# EAGLE design DueShield2 (EAGLE 9.0.1)
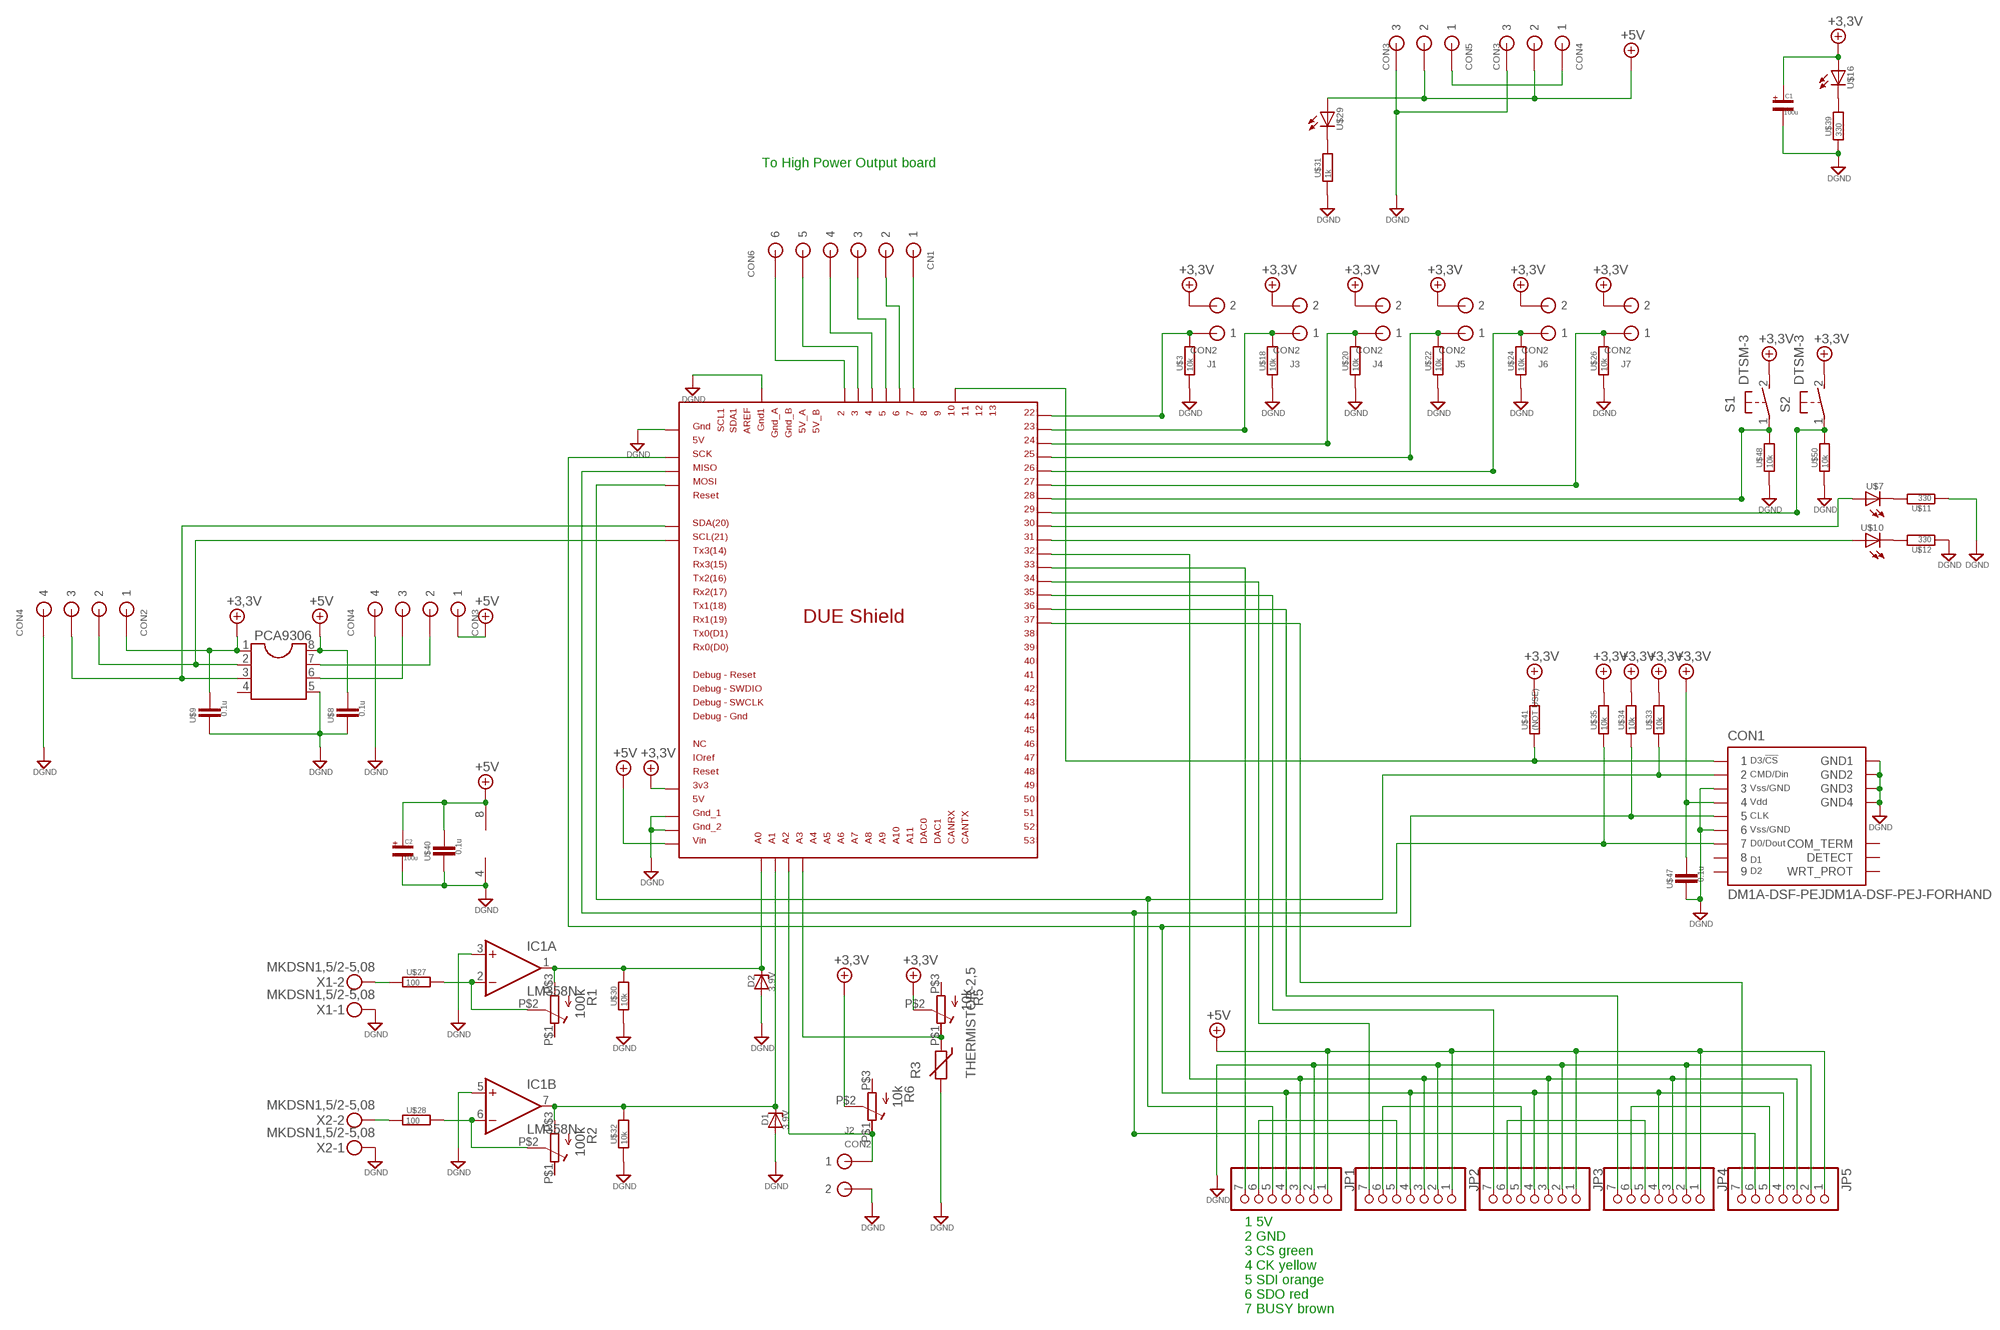
[diagram p0: schematic, sheet 1]

## Parts
C1  100u  コンデンサ(電解)E2.5-6  [D=1,φ=6]
C2  100u  コンデンサ(電解)E2.5-6  [D=1,φ=6]
CN1  CON6  [CON6]
CON1  DM1A-DSF-PEJDM1A-DSF-PEJ-FORHAND  [DM1A-DSF-PEJ-FORHAND]
CON2  CON4  [CON4]
CON3  CON4  [CON4]
CON4  CON3  [CON3]
CON5  CON3  [CON3]
D1  3.9V  (汎用)ツェナーダイオード  [SMD1206]
D2  3.9V  (汎用)ツェナーダイオード  [SMD1206]
IC1  LM358N  [DIL08]
J1  CON2  [CON2]
J2  CON2  [CON2]
J3  CON2  [CON2]
J4  CON2  [CON2]
J5  CON2  [CON2]
J6  CON2  [CON2]
J7  CON2  [CON2]
JP1  PINHD-1X7  [1X07]
JP2  PINHD-1X7  [1X07]
JP3  PINHD-1X7  [1X07]
JP4  PINHD-1X7  [1X07]
JP5  PINHD-1X7  [1X07]
PCA9306  DIL8  [DIL08]
R1  100k  抵抗(可変)  [GF063PB]
R2  100k  抵抗(可変)  [GF063PB]
R3  THERMISTOR-2,5  [RS-2,5]
R5  10k  抵抗(可変)  [GF063PB]
R6  10k  抵抗(可変)  [GF063PB]
S1  DTSM-3  [DTSM-3]
S2  DTSM-3  [DTSM-3]
U$1  DUE(3DPRINTER2)  [DUE(3DPRITNER2)]
U$3  10k  抵抗0805  [0805(JIS2012)HAND]
U$7  LED(砲弾型)3  [LED3MM]
U$8  0.1u  コンデンサ0805  [0805(JIS2012)HAND]
U$9  0.1u  コンデンサ0805  [0805(JIS2012)HAND]
U$10  LED(砲弾型)3  [LED3MM]
U$11  330  抵抗0805  [0805(JIS2012)HAND]
U$12  330  抵抗0805  [0805(JIS2012)HAND]
U$16  LED(砲弾型)3  [LED3MM]
U$18  10k  抵抗0805  [0805(JIS2012)HAND]
U$20  10k  抵抗0805  [0805(JIS2012)HAND]
U$22  10k  抵抗0805  [0805(JIS2012)HAND]
U$24  10k  抵抗0805  [0805(JIS2012)HAND]
U$26  10k  抵抗0805  [0805(JIS2012)HAND]
U$27  100  抵抗0805  [0805(JIS2012)HAND]
U$28  100  抵抗0805  [0805(JIS2012)HAND]
U$29  LED(砲弾型)3  [LED3MM]
U$30  10k  抵抗0805  [0805(JIS2012)HAND]
U$31  1k  抵抗0805  [0805(JIS2012)HAND]
U$32  10k  抵抗0805  [0805(JIS2012)HAND]
U$33  10k  抵抗0805  [0805(JIS2012)HAND]
U$34  10k  抵抗0805  [0805(JIS2012)HAND]
U$35  10k  抵抗0805  [0805(JIS2012)HAND]
U$39  330  抵抗0805  [0805(JIS2012)HAND]
U$40  0.1u  コンデンサ0805  [0805(JIS2012)HAND]
U$41  (NOT USE)  抵抗0805  [0805(JIS2012)HAND]
U$47  0.1u  コンデンサ0805  [0805(JIS2012)HAND]
U$48  10k  抵抗0805  [0805(JIS2012)HAND]
U$50  10k  抵抗0805  [0805(JIS2012)HAND]
X1  MKDSN1,5/2-5,08  [MKDSN1,5/2-5,08]
X2  MKDSN1,5/2-5,08  [MKDSN1,5/2-5,08]

## Nets
+3.3V: C1.+ CON1.4 CON2.P$1 J1.P$2 J3.P$2 J4.P$2 J5.P$2 J6.P$2 J7.P$2 PCA9306.1 R5.P$2(S) R6.P$2(S) S1.2 S2.2 U$1.3V3 U$9.1 U$16.A U$33.2 U$34.2 U$35.2 U$41.2 U$47.1 ; supply symbol labelled +3,3V
+5V: C2.+ CON3.P$1 CON4.P$2 CON5.P$2 IC1.8(P:V+) JP1.1 JP2.1 JP3.1 JP4.1 JP5.1 PCA9306.8 U$1.VIN U$8.1 U$29.A U$40.1
DGND: C1.- C2.- CON1.3 CON1.6 CON1.GND1 CON1.GND2 CON1.GND3 CON1.GND4 CON2.P$4 CON3.P$4 CON4.P$3 CON5.P$3 D1.2(A) D2.2(A) IC1.3(A:+IN) IC1.4(P:V-) IC1.5(B:+IN) J2.P$2 JP1.2 JP2.2 JP3.2 JP4.2 JP5.2 PCA9306.5 R3.2 U$1.5V_ICSP U$1.GND1 U$1.GND_1 U$1.GND_2 U$3.1 U$8.2 U$9.2 U$11.1 U$12.1 U$18.1 U$20.1 U$22.1 U$24.1 U$26.1 U$30.1 U$31.1 U$32.1 U$39.1 U$40.2 U$47.2 U$48.1 U$50.1 X1.1 X2.1
N$1: J1.P$1 U$1.22 U$3.2
N$3: S1.1 U$1.28 U$48.2
N$4: CON1.1 U$1.10 U$41.1
N$5: CON2.P$2 PCA9306.2 U$1.SCL
N$6: CON1.5 JP1.4 JP2.4 JP3.4 JP4.4 JP5.4 U$1.SCK_ICSP U$34.1
N$7: CON2.P$3 PCA9306.3 U$1.SDA
N$8: CON3.P$2 PCA9306.7
N$9: CON3.P$3 PCA9306.6
N$10: JP2.7 U$1.34
N$11: JP3.7 U$1.35
N$12: CN1.P$6 U$1.2
N$13: U$7.K U$11.2
N$14: U$10.K U$12.2
N$15: J2.P$1 R6.P$1(E) U$1.A2
N$16: J3.P$1 U$1.23 U$18.2
N$17: CN1.P$5 U$1.3
N$18: CON4.P$1 CON5.P$1
N$19: R3.1 R5.P$1(E) U$1.A3
N$20: J4.P$1 U$1.24 U$20.2
N$21: J5.P$1 U$1.25 U$22.2
N$22: J6.P$1 U$1.26 U$24.2
N$23: J7.P$1 U$1.27 U$26.2
N$24: CN1.P$3 U$1.5
N$25: CN1.P$2 U$1.6
N$26: CN1.P$1 U$1.7
N$27: CN1.P$4 U$1.4
N$28: IC1.2(A:-IN) R1.P$2(S) U$27.2
N$29: U$29.K U$31.2
N$30: IC1.6(B:-IN) R2.P$2(S) U$28.2
N$31: U$28.1 X2.2
N$32: U$27.1 X1.2
N$33: D2.1(C) IC1.1(A:OUT) R1.P$3(A) U$1.A0 U$30.2
N$34: D1.1(C) IC1.7(B:OUT) R2.P$3(A) U$1.A1 U$32.2
N$35: JP4.7 U$1.36
N$36: JP5.7 U$1.37
N$37: U$16.K U$39.2
N$38: CON1.2 JP1.5 U$1.MOSI_ICSP U$33.1
N$39: CON1.7 JP5.6 U$1.MISO_ICSP U$35.1
N$40: JP2.6 JP3.5
N$41: JP1.3 JP2.3 JP3.3 JP4.3 JP5.3 U$1.32
N$42: JP1.7 U$1.33
N$43: JP1.6 JP2.5
N$44: S2.1 U$1.29 U$50.2
N$45: JP3.6 JP4.5
N$46: JP4.6 JP5.5
N$198: U$1.30 U$7.A
N$199: U$1.31 U$10.A
Unconnected: CON1.8 CON1.9 CON1.COM_TERM CON1.DETECT CON1.WRT_PROT PCA9306.4 R1.P$1(E) R2.P$1(E) R5.P$3(A) R6.P$3(A)

## Notes on the sheet
- To High Power Output board
- 1 5V
  2 GND
  3 CS green
  4 CK yellow
  5 SDI orange
  6 SDO red
  7 BUSY brown

## Library data of the parts
C1 C2 = (Foundation)電解コンデンサ:コンデンサ(電解): POLARIZED CAPACITOR, European symbol
CN1 = (コネクタ)XH:CON6: low insertion connector 6
CON1 = (スロット)SDカード:DM1A-DSF-PEJ: HIROSE DM1A
CON2 CON3 = (コネクタ)XH:CON4: Low insertion connector 4pin
CON4 CON5 = (コネクタ)XH:CON3: low insertion CON
D1 D2 = (半導体)ダイオード:(汎用)ツェナーダイオード: Z DIODE 3.3 V, 1W, 5 percent
IC1 = linear:LM358: OP AMP also LM158; LM258; LM2904 Source: http://cache.national.com/ds/LM/LM158.pdf
J1-J7 = (コネクタ)XH:CON2: low insertion CON
JP1-JP5 = (コネクタ)ピンヘッダ:PINHD-1X7: PIN HEADER
PCA9306 = (半導体)汎用DIP:DIL8: Dual In Line / Socket
R1 R2 R5 R6 = (抵抗)可変抵抗:抵抗(可変): Trimm resistor
R3 = varistor:THERMISTOR: THERMISTOR
S1 S2 = (スイッチ)タクトスイッチ2:DTSM-3
U$1 = (モジュール)ArduinoDue:DUE(3DPRINTER2)
U$3 U$11 U$12 U$18 U$20 U$22 U$24 U$26-U$28 U$30-U$35 U$39 U$41 U$48 U$50 = (Foundation)表面実装RC:抵抗
U$7 U$10 U$16 U$29 = (半導体)LED:LED(砲弾型)
U$8 U$9 U$40 U$47 = (Foundation)表面実装RC:コンデンサ
X1 X2 = con-phoenix-508:MKDSN1,5/2-5,08: MKDSN 1,5/ 2-5,08 Printklemme Nennstrom: 13,5 A Nennspannung: 250 V Rastermaß: 5,08 mm Polzahl: 2 Anschlussart: Schraubanschluss Montage: Löten Anschlussrichtung Leiter/Platine: 0 ° Artikelnummer: 1729128 Source: http://eshop.phoenixcontact.com .. 1729128.pdf

## Board
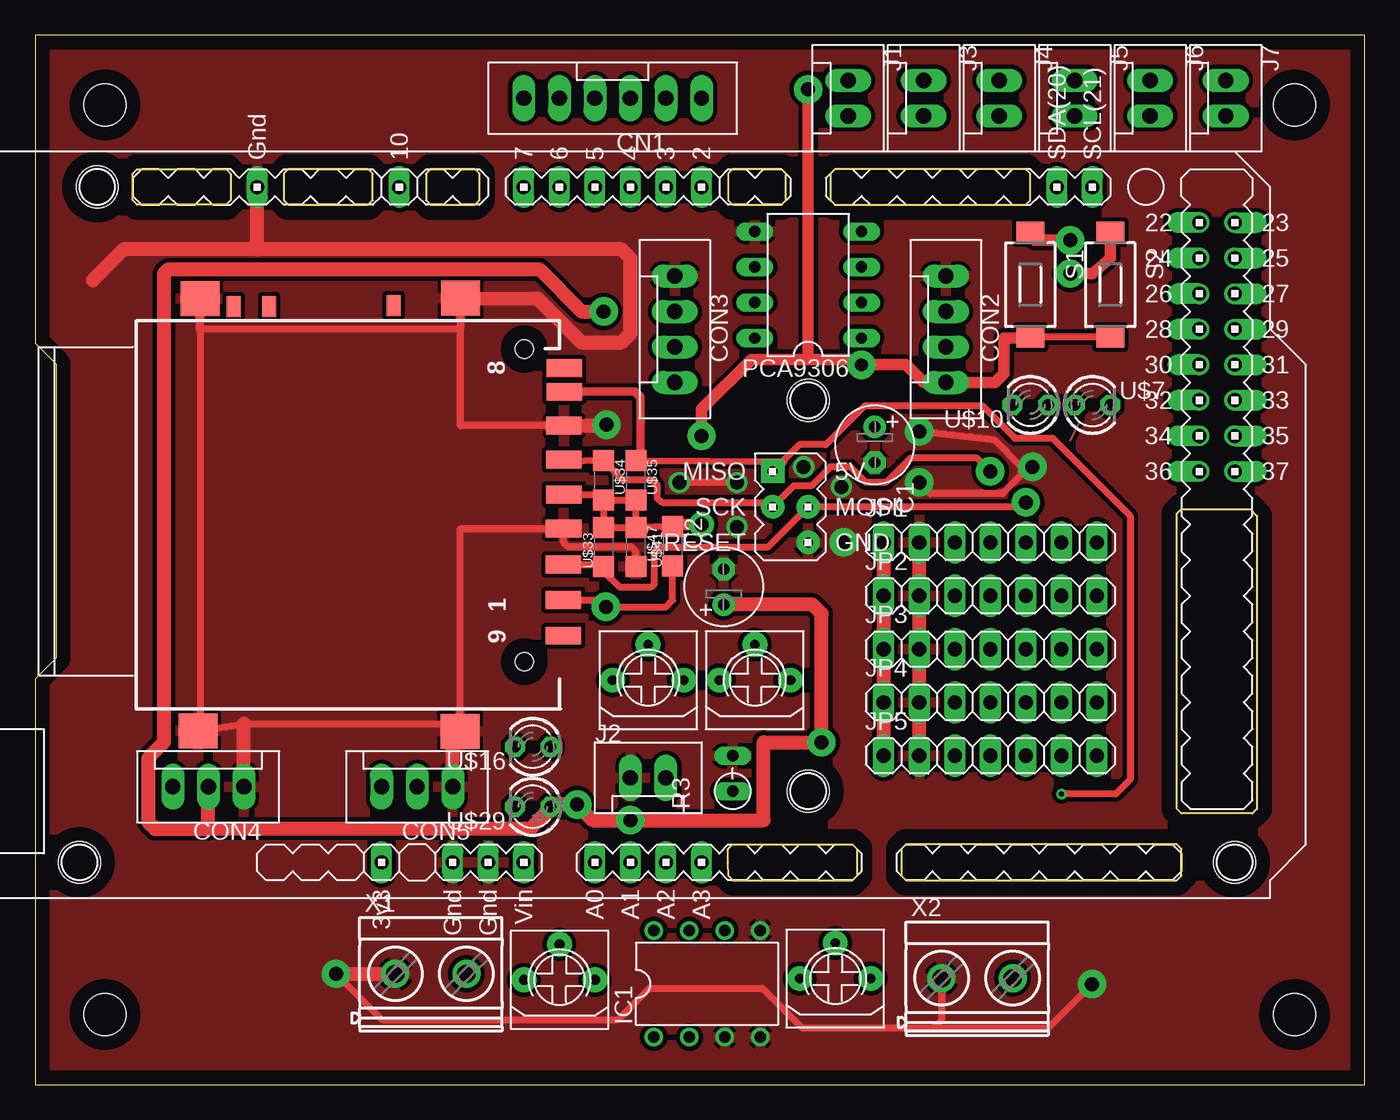
[diagram p1: board, top side]
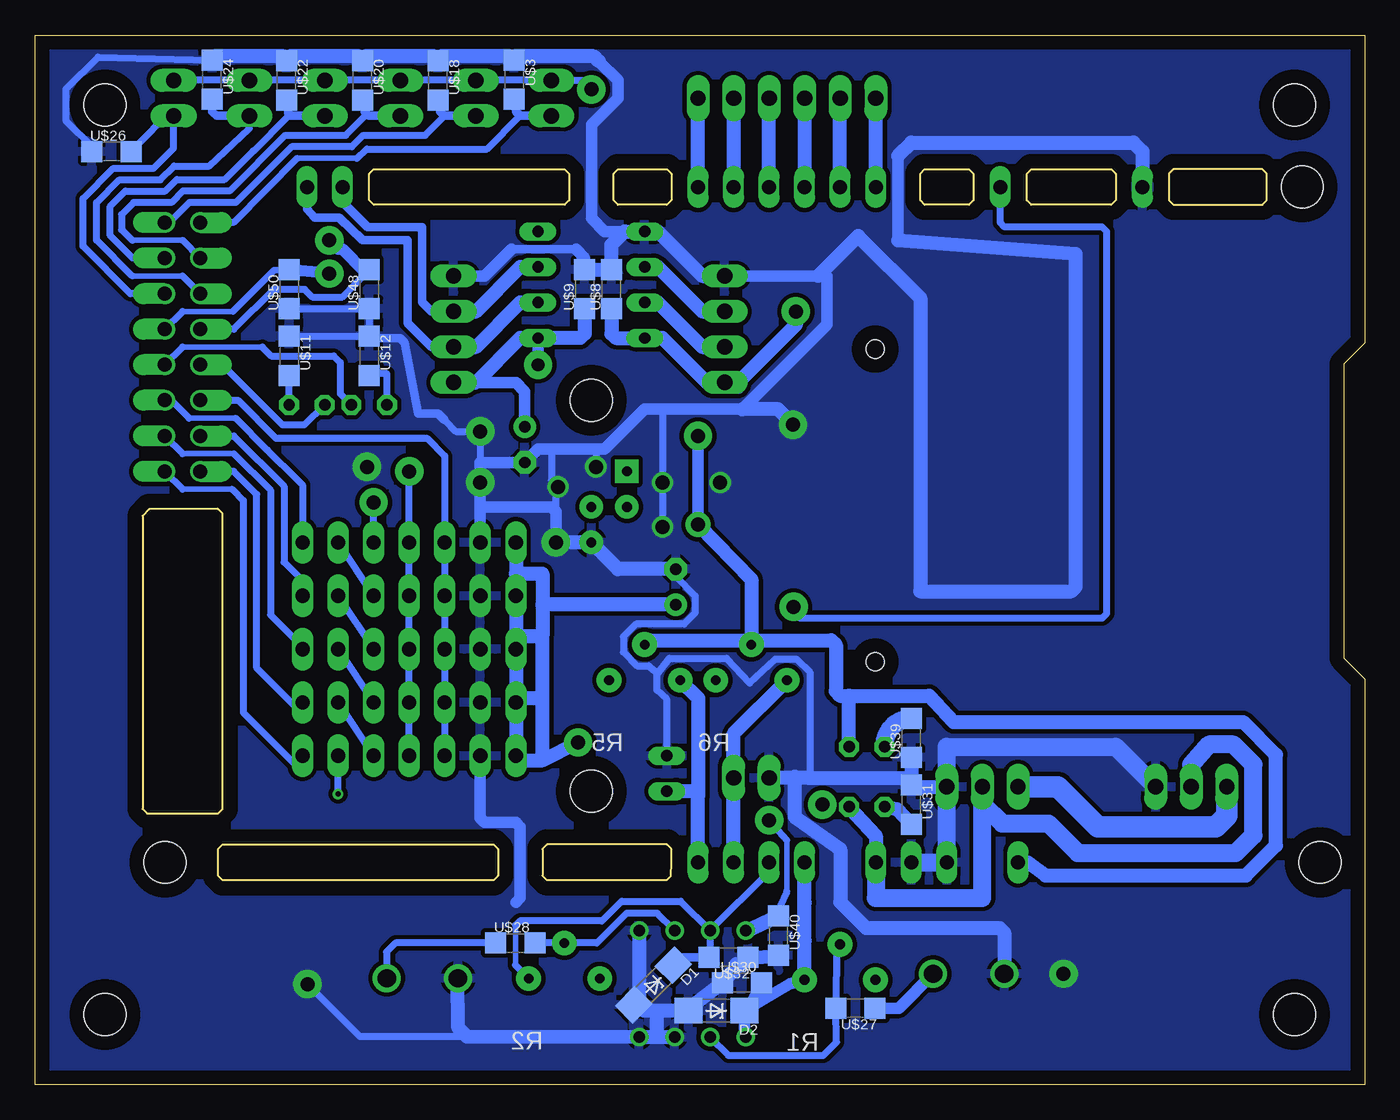
[diagram p2: board, bottom side, seen from below]

Size 95 x 75 mm. Coordinates in mm from the lower left corner, seen from the top.
Outline: 0,0 95,0 95,75 0,75 0,53 1.5,51.5 1.5,30.5 0,29 0,0
Outline: 70.8,62.87 71.12,63.18 71.12,65.09 70.8,65.41 57.15,65.41 56.83,65.09 56.83,63.18 57.15,62.87 70.8,62.87
Outline: 53.34,62.87 53.66,63.18 53.66,65.09 53.34,65.41 49.85,65.41 49.53,65.09 49.53,63.18 49.85,62.87 53.34,62.87
Outline: 31.75,65.09 31.43,65.41 28.26,65.41 27.94,65.09 27.94,63.18 28.26,62.87 31.43,62.87 31.75,63.18 31.75,65.09
Outline: 24.13,63.18 24.13,65.09 23.81,65.41 18.1,65.41 17.78,65.09 17.78,63.18 18.1,62.87 23.81,62.87 24.13,63.18
Outline: 13.97,65.09 13.97,63.18 13.65,62.87 7.3,62.87 6.99,63.18 6.99,65.09 7.3,65.41 13.65,65.41 13.97,65.09
Outline: 61.91,16.83 61.91,14.92 62.23,14.61 81.6,14.61 81.92,14.92 81.92,16.83 81.6,17.14 62.23,17.14 61.91,16.83
Outline: 49.53,16.83 49.85,17.14 58.42,17.14 58.74,16.83 58.74,14.92 58.42,14.61 49.87,14.61 49.86,14.61 49.56,14.91 49.53,15.88 49.53,16.83
Outline: 81.92,41.12 86.84,41.12 87.31,40.64 87.31,19.68 87,19.37 81.92,19.37 81.6,19.68 81.6,40.8 81.92,41.12
Copper layers (1*16): Top 0.035mm / dielectric 1.5mm / Bottom 0.035mm
Design rules "default *": minimum track width 6mil, minimum drill 0.35mm, track to track 12mil, track to pad 12mil, pad to pad 12mil, via to via 12mil, smd to smd 12mil, copper to edge 40mil, drill to drill 6mil, minimum pad ring 10mil, minimum via ring 8mil, stop-mask expansion 4mil, vias tented up to drill 0mil, thermal gap 10mil
Holes 3 mm at 85.72,15.88 55.24,20.95 4.45,64.14 3.17,15.88 55.24,48.9 5,5 90,5 90,70 5,70

### Footprints (pad centres in the part's own frame; a part is rotated, then mirrored left to right if it is on the bottom)
D=1,φ=6 = drill 0.813 pad 1.6: + -1.27,0 | drill 0.813 pad 1.6 octagon: - 1.27,0
CON6 = drill 1.1 long: P$1 6.35,0; P$2 3.81,0; P$3 1.27,0; P$4 -1.27,0; P$5 -3.81,0; P$6 -6.35,0
DM1A-DSF-PEJ-FORHAND = smd 1.27 x 2.54: 1 6.013,16.809; 2 3.488,16.809; 3 0.911,16.813; 4 -1.516,16.84; 5 -4.016,16.84; 6 -6.44,16.84; 7 -8.865,16.866; 8 -10.565,16.866; 9 8.564,16.809 | smd 1.5 x 1: COM_TERM -14.962,-6.752; DETECT -15.032,4.652; WRT_PROT -14.937,-4.238 | smd 2.5 x 2.8: GND1 15.395,9.427; GND2 -15.549,9.452; GND3 -15.523,-9.152; GND4 15.359,-9.305 | hole 1.295: -11.913,14.021; 10.439,14.021
CON4 = drill 1.1 long: P$1 3.81,0; P$2 1.27,0; P$3 -1.27,0; P$4 -3.81,0
CON3 = drill 1.1 long: P$1 2.54,0; P$2 0,0; P$3 -2.54,0
SMD1206 = smd 2 x 1.8: 1 -2,0; 2 2,0
DIL08 = drill 0.813 pad 1.27: 1 -3.81,-3.81; 2 -1.27,-3.81; 3 1.27,-3.81; 4 3.81,-3.81; 5 3.81,3.81; 6 1.27,3.81; 7 -1.27,3.81; 8 -3.81,3.81
CON2 = drill 1.1 long: P$1 1.27,0; P$2 -1.27,0
1X07 = drill 1.016 long: 1 -7.62,0; 2 -5.08,0; 3 -2.54,0; 4 0,0; 5 2.54,0; 6 5.08,0; 7 7.62,0
DIL08' = drill 0.813 long: 1 -3.81,-3.81; 2 -1.27,-3.81; 3 1.27,-3.81; 4 3.81,-3.81; 5 3.81,3.81; 6 1.27,3.81; 7 -1.27,3.81; 8 -3.81,3.81
GF063PB = drill 0.7 pad 1.778: P$1 0,2.54; P$2 2.54,0; P$3 0,-2.54
RS-2,5 = drill 0.813 long: 1 -1.27,0; 2 1.27,0
DTSM-3 = smd 1.5 x 2: 1 -3.75,0; 2 3.75,0
DUE(3DPRITNER2) = drill 1 long: 2 58.42,50.8; 3 55.88,50.8; 4 53.34,50.8; 5 50.8,50.8; 6 48.26,50.8; 7 45.72,50.8; 10 36.83,50.8; GND1 26.67,50.8 | drill 1 pad 1.27 long: 3V3 35.56,2.54; A0 50.8,2.54; A1 53.34,2.54; A2 55.88,2.54; A3 58.42,2.54; GND_1 40.64,2.54; GND_2 43.18,2.54; SCL 86.36,50.8; SDA 83.82,50.8; VIN 45.72,2.54 | drill 0.7 pad 1.676: 5V_ICSP 66.04,25.4; MOSI_ICSP 66.04,27.94; SCK_ICSP 63.5,27.94 | drill 1 pad 1.27 offset: 22 93.98,48.26; 23 96.52,48.26; 24 93.98,45.72; 25 96.52,45.72; 26 93.98,43.18; 27 96.52,43.18; 28 93.98,40.64; 29 96.52,40.64; 30 93.98,38.1; 31 96.52,38.1; 32 93.98,35.56; 33 96.52,35.56; 34 93.98,33.02; 35 96.52,33.02; 36 93.98,30.48; 37 96.52,30.48 | drill 0.7 pad 1.676 square: MISO_ICSP 63.5,30.48
0805(JIS2012)HAND = smd 1.5 x 1.5: 1 -1.4,0; 2 1.4,0
LED3MM = drill 0.813 pad 1.422 octagon: A -1.27,0; K 1.27,0
MKDSN1,5/2-5,08 = drill 1.3 pad 2: 1 -2.561,0.025; 2 2.519,0.025

### Placement (x,y rotation side)
C1  60.01,45.72 270 top
C2  49.21,35.56 90 top
CN1  41.27,70.48 180 top
CON1  20.95,40.64 270 top
CON2  65.09,53.98 270 top
CON3  45.72,53.98 270 top
CON4  12.38,21.27 180 top
CON5  27.3,21.27 180 top
D1  50.8,7.11 225 bottom
D2  46.31,5.29 180 bottom
IC1  48.02,7.19 0 top
J1  58.1,70.48 270 top
J2  43.81,21.91 0 top
J3  63.5,70.48 270 top
J4  68.9,70.48 270 top
J5  74.3,70.48 270 top
J6  79.69,70.48 270 top
J7  85.09,70.48 270 top
JP1  68.26,38.73 0 top
JP2  68.26,34.92 0 top
JP3  68.26,31.11 0 top
JP4  68.26,27.3 0 top
JP5  68.26,23.5 0 top
PCA9306  [DIL08']  55.24,57.15 90 top
R1  37.48,7.48 90 top
R2  57.18,7.57 90 top
R3  49.85,22.23 90 top
R5  51.44,28.89 90 top
R6  43.81,28.89 90 top
S1  71.12,57.15 270 top
S2  76.83,57.15 270 top
U$1  -10.79,13.34 0 top
U$3  60.76,71.79 270 bottom
U$7  75.56,48.56 0 top
U$8  53.82,56.83 90 bottom
U$9  55.72,56.83 90 bottom
U$10  71.12,48.56 180 top
U$11  76.83,52.07 270 bottom
U$12  71.12,52.07 270 bottom
U$16  35.56,24.13 180 top
U$18  66.2,71.75 270 bottom
U$20  71.6,71.75 270 bottom
U$22  77.03,71.75 270 bottom
U$24  82.35,71.79 270 bottom
U$26  89.53,66.67 0 bottom
U$27  36.37,5.46 180 bottom
U$28  60.67,10.11 0 bottom
U$29  35.56,19.84 180 top
U$30  44.49,7.27 0 bottom
U$31  32.38,20 270 bottom
U$32  45.45,9.1 180 bottom
U$33  40.64,38.42 90 top
U$34  40.64,43.18 270 top
U$35  42.94,43.18 270 top
U$39  32.38,24.77 90 bottom
U$40  41.87,10.65 270 bottom
U$41  45.56,38.46 90 top
U$47  42.94,38.42 270 top
U$48  71.12,56.83 90 bottom
U$50  76.83,56.83 90 bottom
X1  28.31,7.89 0 top
X2  67.34,7.57 0 top

### Tracks (layer width: path | path; a pad name or v marks a point on that pad's centre or on a via)
+3.3V  (via drill 0.9 pad 2.03, 1 pad 1.78, 1 pad 2.03)
  Top 0.508: CON1.4 40.31,42.16 U$34.2 | U$34.2 U$35.2 U$47.1 | U$34.2 U$33.2 U$47.1 | S2.2 S1.2 | U$41.2 U$47.1
  Top 0.813: S1.2 71.06,53.34 69.22,53.34 69.22,50.8 68.58,50.16 CON2.P$1 63.5,50.16 62.23,51.44 v59.05,51.44 58.74,51.44 58.35,51.82 55.16,51.82 | U$41.2 45.96,40.01 v47.62,40.01 | 55.16,51.82 51.18,51.82 47.62,48.26 v47.62,46.35 | v55.24,71.12 55.24,51.9 55.16,51.82
  Bottom 0.508: J7.P$2 J6.P$2 J5.P$2 J4.P$2 J3.P$2 J1.P$2 55.88,71.75 v55.24,71.12
  Bottom 0.61: 56.52,53.34 55.72,53.66
  Bottom 0.813: v59.05,51.44 PCA9306.1 | C1.+ 60.01,49.53 60.64,50.16 CON2.P$1 | v47.62,46.35 v47.62,40.01
  Bottom 1.016: U$1.3V3 24.03,15.88 22.77,14.94 8.47,14.94 6.33,17.09 6.33,23.55 8.67,25.9 29.37,25.9 31.09,27.78 36.83,27.78 | CON2.P$1 63.5,50.16 60.33,53.34 PCA9306.1 56.04,53.34 55.72,53.66 U$9.1 | U$16.A 36.83,27.78 | R5.P$2 51.12,31.75 44.13,31.75 R6.P$2 | R6.P$2 43.5,31.75 38.1,31.75 37.78,31.43 37.78,28.1 37.47,27.78 36.83,27.78 | v47.62,40.01 43.81,36.09 R6.P$2
+5V  (via drill 1 pad 2.03)
  Top 1.016: 12.38,18.26 35.4,18.26 U$29.A 37.15,20 v38.73,20 39.85,18.89 v42.55,18.89 52.07,18.89 52.07,24.45 v56.2,24.45 56.2,33.66 55.56,34.29 C2.+ | 12.38,18.26 CON4.P$2 | v40.64,55.24 39.05,55.24 36.04,58.26 9.53,58.26 9.21,57.94 9.21,24.45 8.1,23.34 8.1,18.73 8.57,18.26 12.38,18.26 | JP1.1 JP2.1 JP3.1 JP4.1 JP5.1
  Bottom 0.406: 41.27,17.46 41.27,13.81
  Bottom 0.508: v42.55,18.89 41.27,17.46 | 41.27,13.81 42.06,12.12 | 42.06,12.08 U$40.1
  Bottom 0.61: 42.06,12.12 42.06,12.08
  Bottom 1.016: U$29.A 34.92,17.78 U$1.VIN | U$8.1 53.82,53.66 53.5,53.34 PCA9306.8 50.16,53.34 46.99,50.16 CON3.P$1 45.4,49.85 44.77,49.85 44.77,50.16 40.64,54.29 v40.64,55.24 | IC1.8 44.22,10.96 U$40.1 | v56.2,24.45 58.74,23.18 | 58.74,23.18 58.74,27.62 | 58.74,27.62 58.74,32.07 | 58.74,34.29 58.74,36.51 60.64,36.51 | 58.74,34.29 58.74,32.07 | JP1.1 60.64,36.51 | 60.64,36.51 JP2.1 60.64,32.07 | 60.64,32.07 JP3.1 60.64,27.62 | 60.64,27.62 JP4.1 JP5.1 60.64,23.18 58.74,23.18 | 60.64,27.62 58.74,27.62 | 60.64,32.07 58.74,32.07 | C2.+ 58.74,34.29
  Bottom 1.27: U$1.VIN 34.92,13.34 27.3,13.34 CON5.P$2 27.33,20.66 27.33,20.1 25.88,18.65 22.58,18.65 20.49,16.55 9.2,16.55 7.97,17.78 7.94,17.78 7.94,22.86 9.37,24.29 11.11,24.29 12.38,22.86 CON4.P$2
DGND  (via drill 1 pad 1.52, 1 pad 2.03)
  Top 0.508: CON1.6 30.41,47.08 CON1.GND2 30.41,53.98 11.75,53.98 11.75,55.66 CON1.GND3 11.8,25.78 CON1.GND4 14.92,25.78 29.84,25.78 30.38,25.78 CON1.GND1 30.38,39.73 CON1.3 37.77,38.75 38.1,38.42 42.62,38.42 42.94,38.1 U$47.2 | v50.16,43.02 v46.04,43.02 | 70.48,44.13 70.48,43.58 69.14,42.23 63.98,42.23 v63.18,43.02 | 70.48,44.13 68.58,46.04 v63.18,46.67 | 70.48,44.13 v71.28,44.13 | v21.51,7.91 24.79,4.63 41.65,4.63 43.91,6.88 51.98,6.88 54.8,4.05 64.22,4.05 | 64.22,4.05 64.8,4.63 64.8,7.58 X2.1 | 64.22,4.05 72.41,4.05 v75.53,7.17
  Top 1.016: CON1.6 40.73,47.08 v40.84,47.15 | CON1.GND2 35.91,56.16 39.05,53.02 41.91,53.02 42.55,53.66 42.55,59.05 41.91,59.69 15.88,59.69 | 15.88,59.69 6.35,59.69 4.13,57.47 | 15.88,59.69 U$1.GND1 | CON4.P$3 14.92,25.78 | CON5.P$3 29.84,25.78 | JP5.2 JP4.2 JP3.2 JP2.2 JP1.2 | v21.51,7.91 X1.1
  Bottom 0.508: U$11.1 U$12.1 U$48.1 U$50.1 | U$26.1 90.89,66.97 92.77,68.85 92.77,71.15 90.5,73.42 U$24.1 | 50.57,29.31 50.57,28.2 49.85,27.55 R3.2 | 50.57,29.31 50.57,29.45 51.16,29.92 51.97,29.92 52.95,30.89 52.95,32.01 52.05,32.91 48.62,32.91 47.83,33.71 47.83,34.91 49.21,36.3 C2.- | 50.57,29.31 49.67,30.45 45.58,30.45 43.93,28.68 42.09,30.41 40.58,30.41 39.64,29.47 39.64,22.1 39.69,21.91 | 50.16,48.26 v50.16,43.02 v50.16,39.85 | 63.18,44.45 v63.18,46.67 64.93,46.67 65.72,47.47 | 55.24,45.4 54.93,45.09 v54.93,44.13 | 58.1,45.4 58.1,43.18 v57.63,42.7 57.78,42.55 57.78,40.96 | 64.12,3.42 71.78,3.42 v75.53,7.17
  Bottom 0.61: U$12.1 arc-90 71.04,53.34 68.9,53.34 68.58,53.02 67.63,47.94 66.2,47.94 65.72,47.47 | 63.18,40.96 63.18,40.64 | 60.96,59.69 56.36,59.69
  Bottom 0.813: CON2.P$4 62.87,57.78 60.96,59.69 | 56.36,59.69 55.72,59.05 U$9.2 | CON3.P$4 39.05,57.78 38.42,57.78 38.42,54.29 44.45,48.26 50.16,48.26 51.44,48.26 54.29,45.4 55.24,45.4 58.1,45.4 59.05,45.4 C1.- 63.18,44.45 v63.18,43.02 63.18,41.27 | 63.18,41.27 63.18,40.64 JP1.2 | 54.72,73.14 53.34,71.75 53.34,70.48 55.24,68.58 55.24,61.91 54.29,60.96 52.86,60.96 | JP5.2 63.18,19.05 62.87,18.73 60.64,18.73 60.33,18.41 60.33,13.34 60.64,13.02 | 63.18,41.27 58.1,41.27 57.78,40.96 v57.78,38.73 | 33.34,66.36 33.34,60.33
  Bottom 1.016: U$39.1 32.38,21.91 | 32.38,21.91 U$31.1 32.38,21.27 CON5.P$3 | 50.25,5.29 D2.2 48.31,5.4 U$30.1 46.04,7.19 45.28,7.95 45.04,8.13 44.89,8.6 44.63,8.6 U$32.1 44.05,9.02 U$40.2 | 50.25,5.29 51.49,5.29 D1.2 51.84,5.92 IC1.5 | IC1.3 50.56,3.38 | 50.56,3.38 IC1.4 64.12,3.42 64.76,4.06 64.8,7.57 X2.1 | 50.56,3.38 50.56,4.97 50.25,5.29 | CON3.P$4 47.31,57.78 50.48,60.96 PCA9306.5 52.86,60.96 53.82,60.01 U$8.2 U$9.2 | 39.69,21.91 J2.P$2 | 39.69,21.91 40.72,21.99 40.72,19.13 37.45,16.81 37.45,13.03 35.62,11.2 26.09,11.2 25.75,10.86 X1.1 | v40.84,47.15 41.91,48.26 44.45,48.26 | 39.05,57.78 36.2,60.64 31.75,56.2 31.75,35.24 20.95,35.24 20.64,35.56 20.64,59.37 33.34,60.33 | 33.34,66.36 32.38,67.31 16.51,67.31 15.88,66.67 U$1.GND1 | C2.- 53.34,36.83 U$1.5V_ICSP v57.78,38.73 | 54.72,73.14 55.06,73.48 60.8,73.48 U$3.1 61.01,73.48 66.04,73.48 U$18.1 66.41,73.48 71.44,73.48 U$20.1 71.81,73.48 76.83,73.48 U$22.1 77.21,73.48 82.23,73.48 U$24.1 | 39.69,21.91 32.38,21.91 | v21.51,7.91 v21.5,7.91
  Bottom 1.27: U$1.GND_2 U$1.GND_1 CON5.P$3 29.84,24.13 17.78,24.13 CON4.P$3
  pour Bottom: 0,0 0,75 95,75 95,0
  pour Top: 0,75 95,75 95,0 0,0
N$1
  Bottom 0.406: 71.98,66.19 76.26,66.19
  Bottom 0.508: 71.98,66.19 71.29,66.84 62.7,66.84 60.33,69.22 | 76.26,66.19 80.82,61.59 U$1.22
  Bottom 0.61: U$3.2 60.64,69.53 60.33,69.22 J1.P$1
N$2
  Top 0.152: 74.61,47.35 73.98,46.04
N$3  (via drill 1 pad 2.03)
  Top 0.813: S1.1 71.12,60.64 71.44,60.33 v73.98,60.33
  Bottom 0.508: U$1.28 80.79,53.98 77.95,56.8 75.72,56.8 75.19,56.27 73.03,56.27 U$48.2
  Bottom 0.813: v73.98,60.33 73.34,59.69 73.03,59.69 71.44,58.1 U$48.2
N$4  (via drill 1 pad 2.03)
  Top 0.508: CON1.1 37.78,34.61 40.32,34.61 v40.8,34.13 45.09,34.13 45.56,34.61 U$41.1
  Bottom 0.508: v40.8,34.13 40.32,33.34 18.73,33.34 18.41,33.66 18.41,60.96 18.73,61.28 25.72,61.28 26.04,61.59 U$1.10
N$5
  Bottom 0.61: CON2.P$2 66.67,52.7 68.39,54.41 68.39,60.33 71.6,60.33 73.27,61.95 75.01,61.95 75.56,62.55 U$1.SCL
  Bottom 1.016: CON2.P$2 63.5,52.7 60.33,55.88 PCA9306.2
N$6  (via drill 1 pad 2.03)
  Top 0.508: CON1.5 37.92,44.53 U$34.1 41.98,43.19 44.1,43.19 44.45,42.84 44.45,41.91 44.81,41.59 52.39,41.59 U$1.SCK_ICSP 54.21,42.78 55.48,42.78 56.83,44.13 58.26,44.13 59.37,43.02 60.8,43.02 62.55,44.77 67.31,44.77 v68.26,43.81
  Bottom 0.508: JP5.4 JP4.4 JP3.4 JP2.4 JP1.4 v68.26,43.81
N$7
  Bottom 0.61: CON2.P$3 66.67,55.24 67.35,55.92 67.35,61.28 71.24,61.28 73.03,63.06 U$1.SDA
  Bottom 1.016: PCA9306.3 60.33,58.42 63.5,55.24 CON2.P$3
N$8
  Bottom 1.016: PCA9306.7 50.48,55.88 47.31,52.7 CON3.P$2
N$9
  Bottom 1.016: PCA9306.6 50.48,58.42 47.31,55.24 CON3.P$3
N$10
  Bottom 0.508: JP2.7 75.88,36 77.21,37.33 77.21,42.77 80.79,46.35 U$1.34
N$11
  Bottom 0.406: 84.45,45.09 80.79,45.09
  Bottom 0.508: U$1.35 84.45,45.09 | 80.79,45.09 78.18,42.47 78.18,33.56 75.88,31.27 JP3.7
N$12
  Bottom 1.016: U$1.2 CN1.P$6
N$13
  Bottom 0.508: U$7.K 76.83,50.16 76.92,50.4 U$11.2
N$14
  Bottom 0.508: U$10.K 69.85,50.8 71.04,50.8 U$12.2
N$15
  Bottom 1.016: U$1.A2 J2.P$1 45.09,25.08 R6.P$1
N$16
  Bottom 0.508: U$1.23 85.41,61.59 83.98,63.02 80.64,63.02 76.66,67.01 72.37,67.01 71.55,67.83 67.11,67.83 65.72,69.22
  Bottom 0.61: U$18.2 66.04,69.53 65.72,69.22 J3.P$1
N$17
  Bottom 1.016: CN1.P$5 U$1.3
N$18
  Bottom 1.524: CON4.P$1 9.84,19.21 10.64,18.41 19.05,18.41 21.91,21.27 CON5.P$1
N$19
  Bottom 1.016: U$1.A3 47.62,20.64 | 47.62,20.64 47.94,20.95 R3.1 | R5.P$1 47.62,27.62 47.62,20.64
N$20
  Bottom 0.406: 84.45,60.33 88.05,60.33 88.05,60.32
  Bottom 0.508: 88.05,60.32 88.81,61.08 88.81,62.17 87.95,63.02 85.25,63.02 84.43,63.84 81.1,63.84 77.11,67.83 72.8,67.83 71.41,69.22 71.12,69.22 | U$1.24 84.45,60.33
  Bottom 0.61: U$20.2 71.44,69.53 71.12,69.22 J4.P$1
N$21
  Bottom 0.508: U$1.25 88.03,59.05 89.62,60.65 89.62,62.76 88.54,63.84 85.68,63.84 84.86,64.66 81.45,64.66 79.41,66.7 79.39,66.7 76.88,69.22 | 75.81,69.22 J5.P$1
  Bottom 0.61: U$22.2 76.88,69.22 J5.P$1
N$22
  Bottom 0.406: 84.45,57.78 88.05,57.78
  Bottom 0.508: U$1.26 84.45,57.78 | 88.05,57.78 90.59,60.33 90.59,63.03 88.97,64.66 86.04,64.66 85.07,65.63 82.54,65.63 79.69,68.32 J6.P$1
  Bottom 0.61: U$24.2 82.35,69.53 82.03,69.22 J6.P$1
N$23
  Bottom 0.508: U$1.27 88.18,56.52 91.56,59.9 91.56,63.31 89.4,65.47 86.52,65.47 85.09,66.9 J7.P$1 | U$26.2 86.04,68.82 86.04,69.22
  Bottom 0.61: 86.04,69.22 J7.P$1
N$24
  Bottom 1.016: CN1.P$3 U$1.5
N$25
  Bottom 1.016: U$1.6 CN1.P$2
N$26
  Bottom 1.016: U$1.7 CN1.P$1
N$27
  Bottom 1.016: U$1.4 CN1.P$4
N$28
  Bottom 0.508: R1.P$2 37.72,9.98 U$27.2 37.72,3.03 38.66,2.09 45.46,2.09 IC1.2
N$29
  Bottom 1.016: U$29.K 33.42,19.68 U$31.2
N$30
  Bottom 0.508: IC1.6 50.54,12.24 52.72,12.24 54.85,10.11 R2.P$2 U$28.2
N$31
  Bottom 0.508: U$28.1 69.25,10.11 69.88,9.47 69.88,7.62 X2.2
N$32
  Bottom 0.813: U$27.1 33.26,5.45 X1.2
N$33
  Bottom 0.813: U$30.2 43.82,5.77 D2.1 | D2.1 44.31,3.47 IC1.1 | D2.1 41.04,7.19 R1.P$3
  Bottom 1.016: R1.P$3 40,7.74 40,10.28 40.01,13.02 U$1.A0
N$34
  Bottom 0.406: 60.67,8.52 60.67,11.38
  Bottom 0.508: R2.P$3 60.67,8.52 | 60.67,11.38 60.36,11.7 54.48,11.7 53.07,13.11 48.86,13.11 IC1.7 | IC1.7 46.76,9.18 U$32.2 | IC1.7 42.55,15.21 U$1.A1
  Bottom 0.61: U$32.2 48.66,9.1 D1.1
N$35
  Bottom 0.508: JP4.7 75.88,26.5 79.15,29.76 79.15,42.18 80.79,43.81 U$1.36
N$36
  Bottom 0.406: 84.45,42.55 80.92,42.55
  Bottom 0.508: U$1.37 84.45,42.55 | JP5.7 75.88,22.35 80.12,26.59 80.12,41.75 80.92,42.55
N$37
  Bottom 1.27: U$16.K 34.29,24.21 arc90 U$39.2
N$38  (via drill 1 pad 2.03)
  Top 0.508: CON1.2 40.41,37.15 | 40.41,37.15 U$33.1 | 40.64,37.47 U$33.1 | v70.8,41.59 70.48,41.27 U$1.MOSI_ICSP 52.39,38.42 44.61,38.42 44.25,38.06 44.25,35.76 44.05,35.56 41.75,35.56 40.64,36.67 U$33.1 | 40.41,37.15
  Bottom 0.508: JP1.5 v70.8,41.59
N$39  (via drill 0.35)
  Top 0.508: 38.2,49.51 CON1.7 | 43.26,44.45 U$35.1 53.52,44.53 52.73,43.84 | 52.73,43.84 52.39,43.84 52.39,43.81 U$1.MISO_ICSP 52.73,43.84 | 52.73,43.84 54.61,45.72 56.52,45.72 59.27,48.47 67.73,48.47 70.01,46.2 72.71,46.2 78.26,40.64 78.26,21.79 77.23,20.76 v73.34,20.76
  Top 0.61: CON1.7 39.08,49.51 42.86,49.53 43.26,49.14 43.26,46.04 43.26,46.03 43.26,44.45
  Bottom 0.508: v73.34,20.76 JP5.6
N$40
  Bottom 0.508: JP2.6 JP3.5
N$41
  Bottom 0.508: JP5.3 JP4.3 JP3.3 JP2.3 JP1.3 65.72,44.93 66.99,46.2 77.79,46.2 80.49,48.9 U$1.32 80.63,48.9
N$42
  Bottom 0.406: 80.67,47.62 83.98,47.62
  Bottom 0.508: U$1.33 85.26,48.9 83.98,47.62 | JP1.7 75.88,42.86 76.2,43.17 78.4,45.35 80.67,47.62
N$43
  Bottom 0.508: JP1.6 JP2.5
N$44  (via drill 1 pad 2.03)
  Top 0.813: S2.1 76.83,59.05 75.56,57.95 v73.98,57.95
  Bottom 0.406: 84.46,55.24 80.86,55.24
  Bottom 0.508: U$1.29 84.46,55.24 | U$50.2 77.92,58.18 80.86,55.24
  Bottom 0.813: U$50.2 74.38,58.03 v73.98,57.95
N$45
  Bottom 0.508: JP3.6 JP4.5
N$46
  Bottom 0.508: JP4.6 JP5.5
N$198
  Bottom 0.508: U$7.A 75.77,47.14 77.32,47.14 81.68,51.49 U$1.30
N$199
  Bottom 0.406: 84.45,52.71 78.76,52.71
  Bottom 0.508: 78.76,52.71 78.12,52.07 73.66,52.07 73.18,51.59 73.18,49.37 U$10.A | U$1.31 84.45,52.71